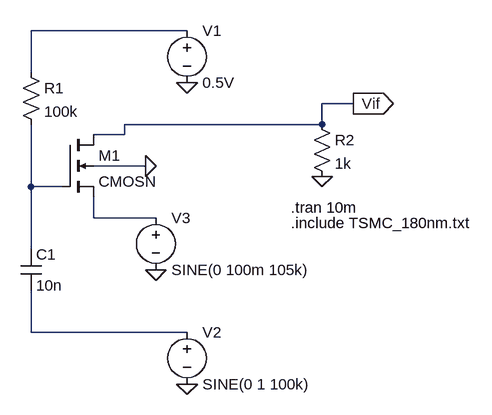
[diagram p0: schematic project_mixer.asc]
project_mixer.asc, the LTspice schematic file:
Version 4
SHEET 1 880 680
WIRE 352 -64 112 -64
WIRE 112 0 112 -64
WIRE 608 48 560 48
WIRE 560 80 560 48
WIRE 560 80 256 80
WIRE 256 96 256 80
WIRE 256 96 208 96
WIRE 288 144 208 144
WIRE 112 176 112 80
WIRE 160 176 112 176
WIRE 208 224 208 192
WIRE 304 224 208 224
WIRE 112 272 112 176
WIRE 112 400 112 336
WIRE 352 400 112 400
FLAG 352 16 0
FLAG 352 480 0
FLAG 560 160 0
FLAG 288 144 0
FLAG 304 304 0
FLAG 608 48 Vif
IOPIN 608 48 Out
SYMBOL nmos4 160 96 R0
SYMATTR InstName M1
SYMATTR Value CMOSN
SYMATTR Value2 l=0.18u w=1.8u ad=0.81p as=0.81p pd=5.4u ps=5.4u
SYMBOL res 96 -16 R0
SYMATTR InstName R1
SYMATTR Value 100k
SYMBOL cap 96 272 R0
SYMATTR InstName C1
SYMATTR Value 10n
SYMBOL voltage 352 -80 R0
WINDOW 123 0 0 Left 0
WINDOW 39 0 0 Left 0
SYMATTR InstName V1
SYMATTR Value 0.5V
SYMBOL voltage 352 384 R0
WINDOW 123 0 0 Left 0
WINDOW 39 0 0 Left 0
SYMATTR InstName V2
SYMATTR Value SINE(0 1 100k)
SYMBOL res 544 64 R0
SYMATTR InstName R2
SYMATTR Value 1k
SYMBOL voltage 304 208 R0
WINDOW 123 0 0 Left 0
WINDOW 39 0 0 Left 0
SYMATTR InstName V3
SYMATTR Value SINE(0 100m 105k)
TEXT 512 208 Left 2 !.tran 10m
TEXT 512 232 Left 2 !.include TSMC_180nm.txt

The netlist it stands for:
* project_mixer.asc
M1 Vif N002 N003 0 CMOSN l=0.18u w=1.8u ad=0.81p as=0.81p pd=5.4u ps=5.4u
R1 N001 N002 100k
C1 N002 N004 10n
V1 N001 0 0.5V
V2 N004 0 SINE(0 1 100k)
R2 Vif 0 1k
V3 N003 0 SINE(0 100m 105k)
.model NMOS NMOS
.model PMOS PMOS
.lib standard.mos
.tran 10m
.include TSMC_180nm.txt
.backanno
.end